# EAGLE design simplux (EAGLE 5.10)
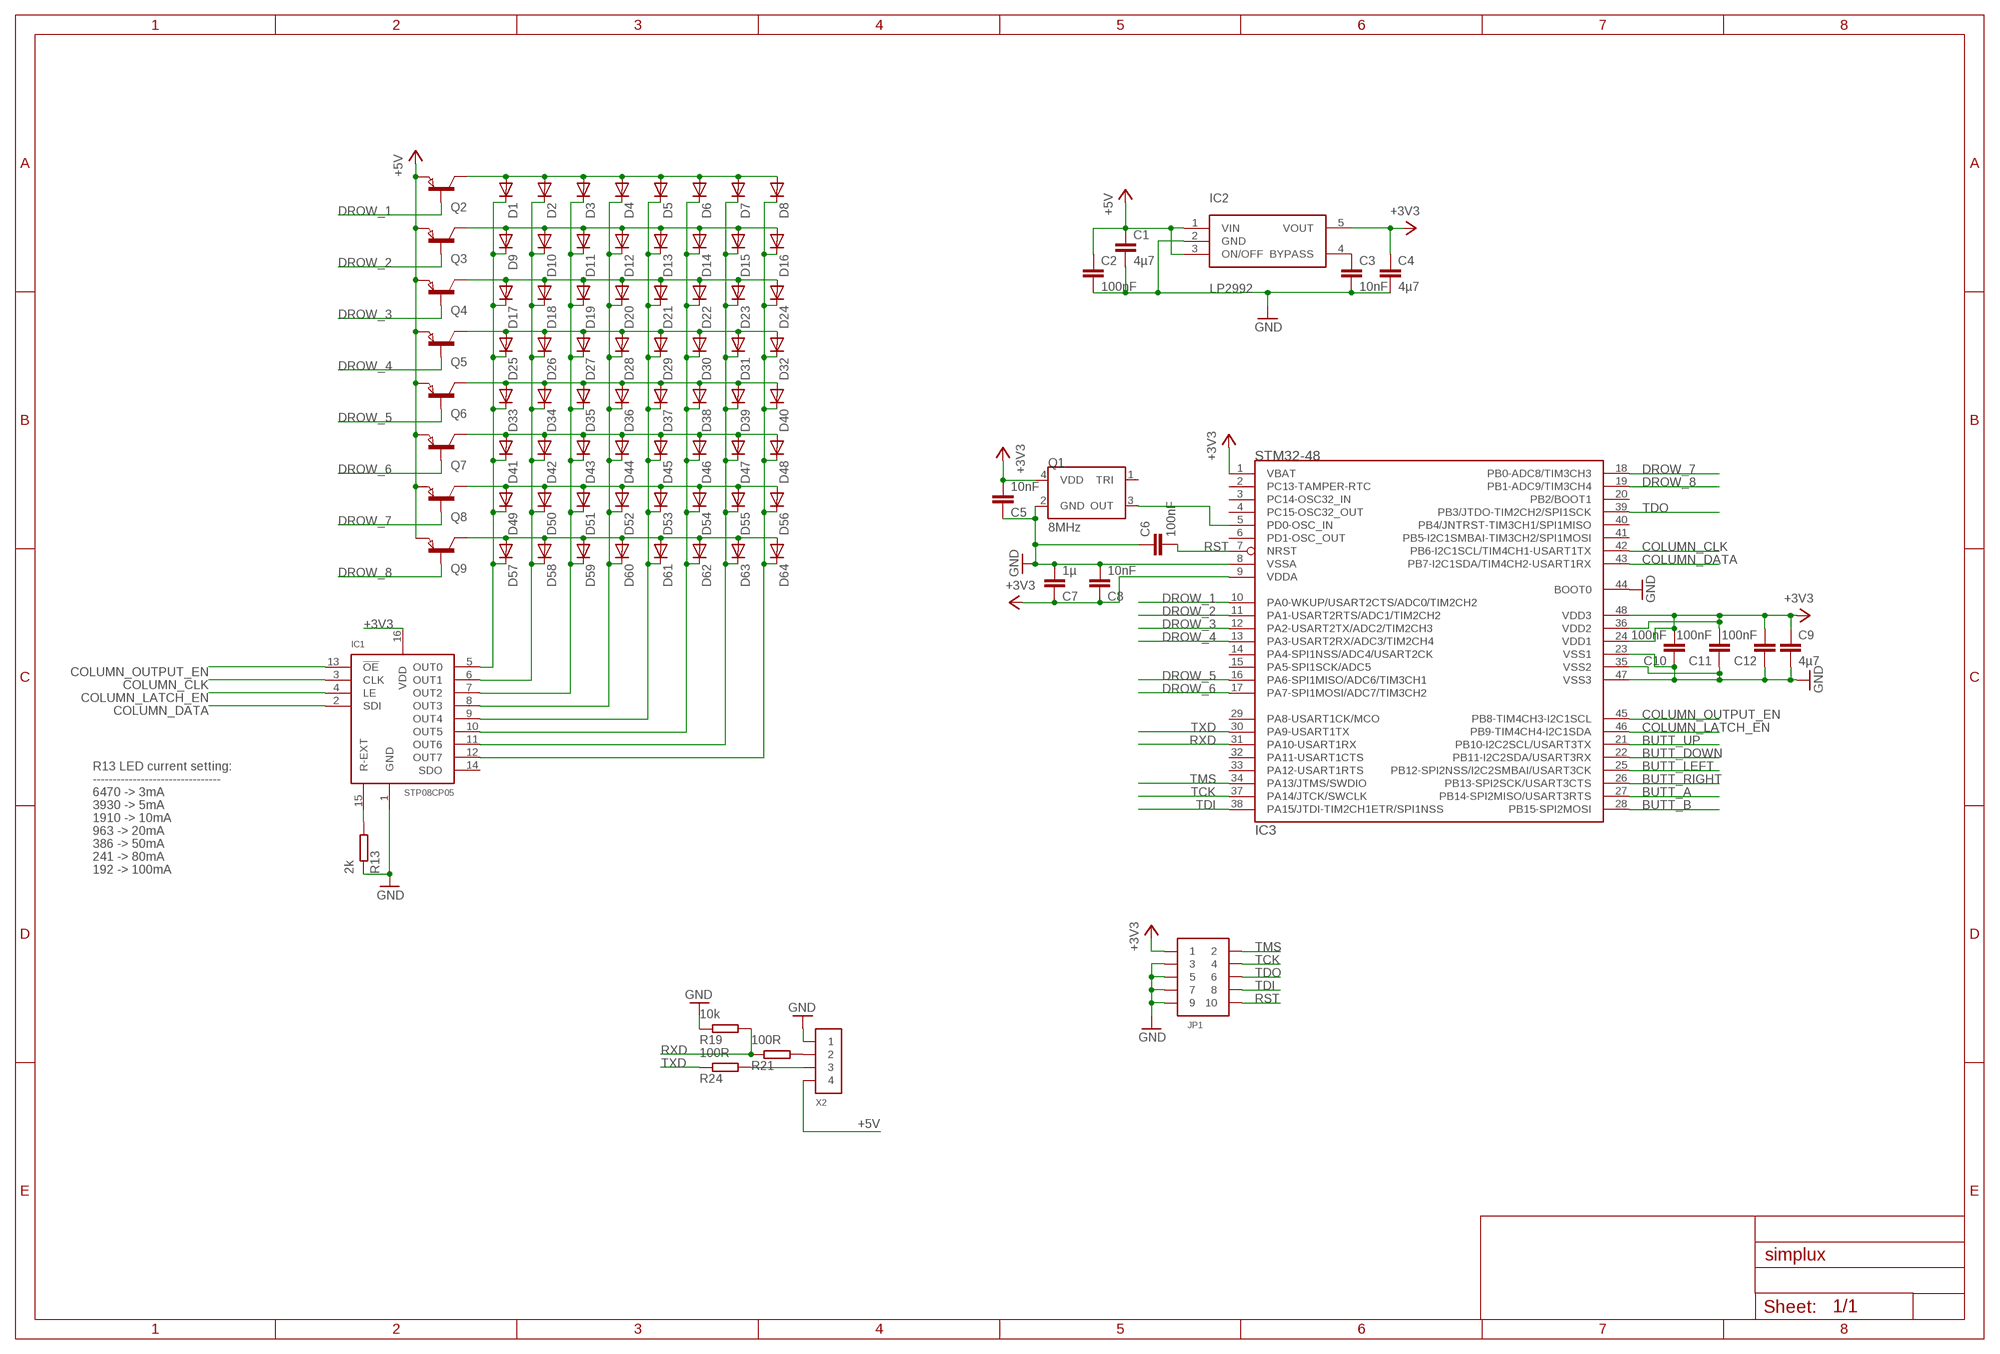
[diagram p0: schematic, sheet 1]

## Parts
C1  4µ7  CAPACITOR-0603  [0603-CAP]
C2  100nF  CAPACITOR-0603  [0603-CAP]
C3  10nF  CAPACITOR-0603  [0603-CAP]
C4  4µ7  CAPACITOR-0603  [0603-CAP]
C5  10nF  CAPACITOR-0603  [0603-CAP]
C6  100nF  CAPACITOR-0603  [0603-CAP]
C7  1µ  CAPACITOR-0603  [0603-CAP]
C8  10nF  CAPACITOR-0603  [0603-CAP]
C9  4µ7  CAPACITOR-0603  [0603-CAP]
C10  100nF  CAPACITOR-0603  [0603-CAP]
C11  100nF  CAPACITOR-0603  [0603-CAP]
C12  100nF  CAPACITOR-0603  [0603-CAP]
D1  DIODE-0603  [0603-LED]
D2  DIODE-0603  [0603-LED]
D3  DIODE-0603  [0603-LED]
D4  DIODE-0603  [0603-LED]
D5  DIODE-0603  [0603-LED]
D6  DIODE-0603  [0603-LED]
D7  DIODE-0603  [0603-LED]
D8  DIODE-0603  [0603-LED]
D9  DIODE-0603  [0603-LED]
D10  DIODE-0603  [0603-LED]
D11  DIODE-0603  [0603-LED]
D12  DIODE-0603  [0603-LED]
D13  DIODE-0603  [0603-LED]
D14  DIODE-0603  [0603-LED]
D15  DIODE-0603  [0603-LED]
D16  DIODE-0603  [0603-LED]
D17  DIODE-0603  [0603-LED]
D18  DIODE-0603  [0603-LED]
D19  DIODE-0603  [0603-LED]
D20  DIODE-0603  [0603-LED]
D21  DIODE-0603  [0603-LED]
D22  DIODE-0603  [0603-LED]
D23  DIODE-0603  [0603-LED]
D24  DIODE-0603  [0603-LED]
D25  DIODE-0603  [0603-LED]
D26  DIODE-0603  [0603-LED]
D27  DIODE-0603  [0603-LED]
D28  DIODE-0603  [0603-LED]
D29  DIODE-0603  [0603-LED]
D30  DIODE-0603  [0603-LED]
D31  DIODE-0603  [0603-LED]
D32  DIODE-0603  [0603-LED]
D33  DIODE-0603  [0603-LED]
D34  DIODE-0603  [0603-LED]
D35  DIODE-0603  [0603-LED]
D36  DIODE-0603  [0603-LED]
D37  DIODE-0603  [0603-LED]
D38  DIODE-0603  [0603-LED]
D39  DIODE-0603  [0603-LED]
D40  DIODE-0603  [0603-LED]
D41  DIODE-0603  [0603-LED]
D42  DIODE-0603  [0603-LED]
D43  DIODE-0603  [0603-LED]
D44  DIODE-0603  [0603-LED]
D45  DIODE-0603  [0603-LED]
D46  DIODE-0603  [0603-LED]
D47  DIODE-0603  [0603-LED]
D48  DIODE-0603  [0603-LED]
D49  DIODE-0603  [0603-LED]
D50  DIODE-0603  [0603-LED]
D51  DIODE-0603  [0603-LED]
D52  DIODE-0603  [0603-LED]
D53  DIODE-0603  [0603-LED]
D54  DIODE-0603  [0603-LED]
D55  DIODE-0603  [0603-LED]
D56  DIODE-0603  [0603-LED]
D57  DIODE-0603  [0603-LED]
D58  DIODE-0603  [0603-LED]
D59  DIODE-0603  [0603-LED]
D60  DIODE-0603  [0603-LED]
D61  DIODE-0603  [0603-LED]
D62  DIODE-0603  [0603-LED]
D63  DIODE-0603  [0603-LED]
D64  DIODE-0603  [0603-LED]
IC1  STP08CP05  [TSSOP16]
IC2  LP2992  [SOT23-5]
IC3  STM32-48  [LQFP48]
JP1  PIN_HDR_EDG_1.27MM_5-2-DH  [PIN_HDR_1.27MM_SMD_DH_10]
Q1  8MHz  ASE_ASCILLATOR  [ASE_OSCILLATOR]
Q2  PNP-TRANSISTOR_SOT23  [SOT23]
Q3  PNP-TRANSISTOR_SOT23  [SOT23]
Q4  PNP-TRANSISTOR_SOT23  [SOT23]
Q5  PNP-TRANSISTOR_SOT23  [SOT23]
Q6  PNP-TRANSISTOR_SOT23  [SOT23]
Q7  PNP-TRANSISTOR_SOT23  [SOT23]
Q8  PNP-TRANSISTOR_SOT23  [SOT23]
Q9  PNP-TRANSISTOR_SOT23  [SOT23]
R13  2k  RESISTOR-0603  [0603-RES]
R19  10k  RESISTOR-0603  [0603-RES]
R21  100R  RESISTOR-0603  [0603-RES]
R24  100R  RESISTOR-0603  [0603-RES]
X2  CONN_4-1-53261  [PB-53261-04]

## Nets
+3V3: C4.P$1 C5.P$2 C7.P$1 C8.P$1 C9.P$1 C10.P$2 C11.P$2 C12.P$2 IC1.16(VDD) IC2.5(VOUT) IC3.1(VBAT) IC3.9(VDDA) IC3.24(VDD1) IC3.36(VDD2) IC3.48(VDD3) JP1.1 Q1.4(VDD)
+5V: C1.P$1 C2.P$1 IC2.1(VIN) IC2.3(ON/OFF) Q2.2(E) Q3.2(E) Q4.2(E) Q5.2(E) Q6.2(E) Q7.2(E) Q8.2(E) Q9.2(E) X2.4
BUTT_A: IC3.27(PB14-SPI2MISO/USART3RTS)
BUTT_B: IC3.28(PB15-SPI2MOSI)
BUTT_DOWN: IC3.22(PB11-I2C2SDA/USART3RX)
BUTT_LEFT: IC3.25(PB12-SPI2NSS/I2C2SMBAI/USART3CK)
BUTT_RIGHT: IC3.26(PB13-SPI2SCK/USART3CTS)
BUTT_UP: IC3.21(PB10-I2C2SCL/USART3TX)
COL_A: D1.C D9.C D17.C D25.C D33.C D41.C D49.C D57.C IC1.5(OUT0)
COL_B: D2.C D10.C D18.C D26.C D34.C D42.C D50.C D58.C IC1.6(OUT1)
COL_C: D3.C D11.C D19.C D27.C D35.C D43.C D51.C D59.C IC1.7(OUT2)
COL_D: D4.C D12.C D20.C D28.C D36.C D44.C D52.C D60.C IC1.8(OUT3)
COL_E: D5.C D13.C D21.C D29.C D37.C D45.C D53.C D61.C IC1.9(OUT4)
COL_F: D6.C D14.C D22.C D30.C D38.C D46.C D54.C D62.C IC1.10(OUT5)
COL_G: D7.C D15.C D23.C D31.C D39.C D47.C D55.C D63.C IC1.11(OUT6)
COL_H: D8.C D16.C D24.C D32.C D40.C D48.C D56.C D64.C IC1.12(OUT7)
COLUMN_CLK: IC1.3(CLK) IC3.42(PB6-I2C1SCL/TIM4CH1-USART1TX)
COLUMN_DATA: IC1.2(SDI) IC3.43(PB7-I2C1SDA/TIM4CH2-USART1RX)
COLUMN_LATCH_EN: IC1.4(LE) IC3.46(PB9-TIM4CH4-I2C1SDA)
COLUMN_OUTPUT_EN: IC1.13(!OE) IC3.45(PB8-TIM4CH3-I2C1SCL)
DROW_1: IC3.10(PA0-WKUP/USART2CTS/ADC0/TIM2CH2) Q2.1(B)
DROW_2: IC3.11(PA1-USART2RTS/ADC1/TIM2CH2) Q3.1(B)
DROW_3: IC3.12(PA2-USART2TX/ADC2/TIM2CH3) Q4.1(B)
DROW_4: IC3.13(PA3-USART2RX/ADC3/TIM2CH4) Q5.1(B)
DROW_5: IC3.16(PA6-SPI1MISO/ADC6/TIM3CH1) Q6.1(B)
DROW_6: IC3.17(PA7-SPI1MOSI/ADC7/TIM3CH2) Q7.1(B)
DROW_7: IC3.18(PB0-ADC8/TIM3CH3) Q8.1(B)
DROW_8: IC3.19(PB1-ADC9/TIM3CH4) Q9.1(B)
GND: C1.P$2 C2.P$2 C3.P$2 C4.P$2 C5.P$1 C6.P$1 C7.P$2 C8.P$2 C9.P$2 C10.P$1 C11.P$1 C12.P$1 IC1.1(GND) IC2.2(GND) IC3.8(VSSA) IC3.23(VSS1) IC3.35(VSS2) IC3.44(BOOT0) IC3.47(VSS3) JP1.3 JP1.5 JP1.7 JP1.9 Q1.2(GND) R13.P$1 R19.P$1 X2.1
N$2: IC1.15(R-EXT) R13.P$2
N$6: R21.P$2 X2.2
N$20: R24.P$2 X2.3
N$22: C3.P$1 IC2.4(BYPASS)
N$40: IC3.5(PD0-OSC_IN) Q1.3(OUT)
ROW_1: D1.A D2.A D3.A D4.A D5.A D6.A D7.A D8.A Q2.3(C)
ROW_2: D9.A D10.A D11.A D12.A D13.A D14.A D15.A D16.A Q3.3(C)
ROW_3: D17.A D18.A D19.A D20.A D21.A D22.A D23.A D24.A Q4.3(C)
ROW_4: D25.A D26.A D27.A D28.A D29.A D30.A D31.A D32.A Q5.3(C)
ROW_5: D33.A D34.A D35.A D36.A D37.A D38.A D39.A D40.A Q6.3(C)
ROW_6: D41.A D42.A D43.A D44.A D45.A D46.A D47.A D48.A Q7.3(C)
ROW_7: D49.A D50.A D51.A D52.A D53.A D54.A D55.A D56.A Q8.3(C)
ROW_8: D57.A D58.A D59.A D60.A D61.A D62.A D63.A D64.A Q9.3(C)
RST: C6.P$2 IC3.7(NRST) JP1.10
RXD: IC3.31(PA10-USART1RX) R19.P$2 R21.P$1
TCK: IC3.37(PA14/JTCK/SWCLK) JP1.4
TDI: IC3.38(PA15/JTDI-TIM2CH1ETR/SPI1NSS) JP1.8
TDO: IC3.39(PB3/JTDO-TIM2CH2/SPI1SCK) JP1.6
TMS: IC3.34(PA13/JTMS/SWDIO) JP1.2
TXD: IC3.30(PA9-USART1TX) R24.P$1
Unconnected: IC1.14(SDO) IC3.2(PC13-TAMPER-RTC) IC3.3(PC14-OSC32_IN) IC3.4(PC15-OSC32_OUT) IC3.6(PD1-OSC_OUT) IC3.14(PA4-SPI1NSS/ADC4/USART2CK) IC3.15(PA5-SPI1SCK/ADC5) IC3.20(PB2/BOOT1) IC3.29(PA8-USART1CK/MCO) IC3.32(PA11-USART1CTS) IC3.33(PA12-USART1RTS) IC3.40(PB4/JNTRST-TIM3CH1/SPI1MISO) IC3.41(PB5-I2C1SMBAI-TIM3CH2/SPI1MOSI) Q1.1(TRI)

## Notes on the sheet
- R13 LED current setting:
- --------------------------------
- 6470 -> 3mA
- 3930 -> 5mA
- 1910 -> 10mA
- 963 -> 20mA
- 386 -> 50mA
- 241 -> 80mA
- 192 -> 100mA

## Library data of the parts
C1-C12 = pel_dipol_comp:CAPACITOR
D1-D64 = pel_dipol_comp:DIODE
IC1 = booz:STP08CP05
IC2 = open-bldc:LP2992
IC3 = open-bldc:STM32-48
JP1 = open-bldc:PIN_HDR_EDG_1.27MM_5-2
Q1 = open-bldc:ASE_ASCILLATOR
Q2-Q9 = semicon-smd-ipc:PNP-TRANSISTOR_: PNP TRANSISTOR
R13 R19 R21 R24 = pel_dipol_comp:RESISTOR
X2 = pel_molex:CONN_4-1

## Board
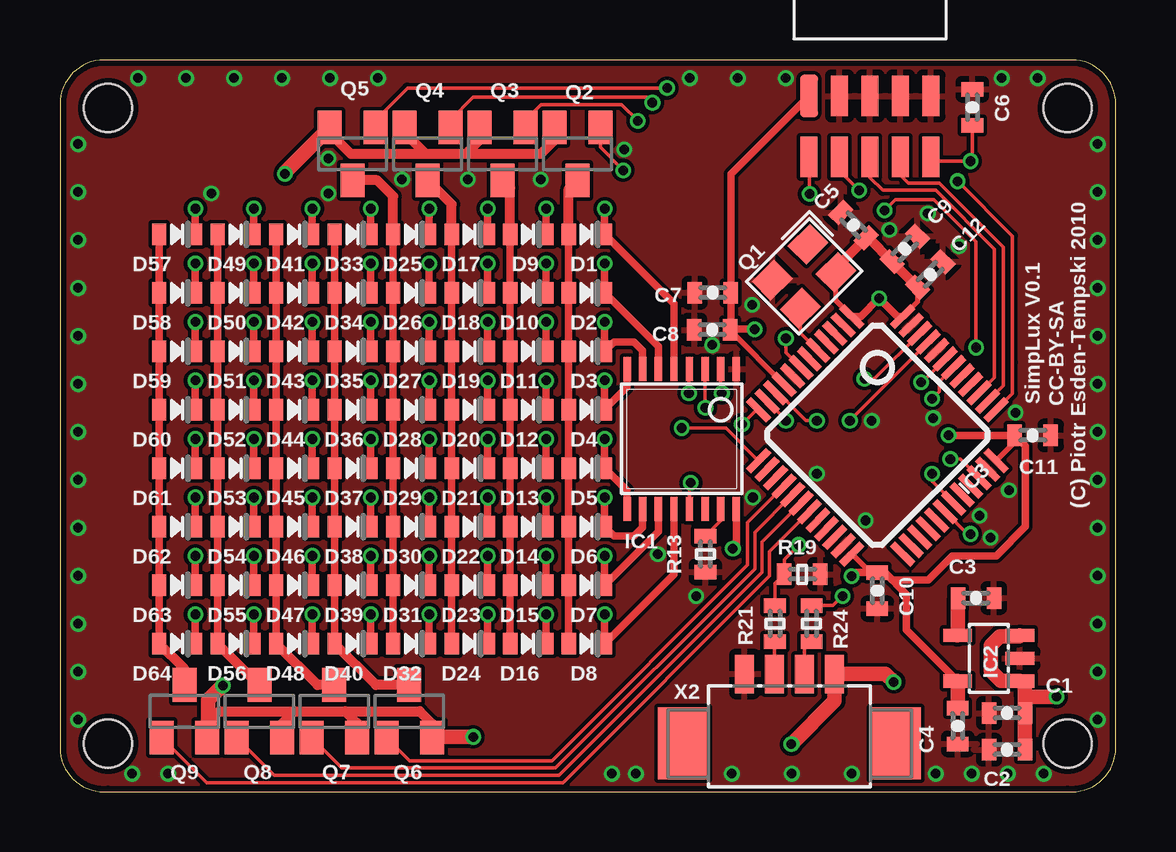
[diagram p1: board, top side]
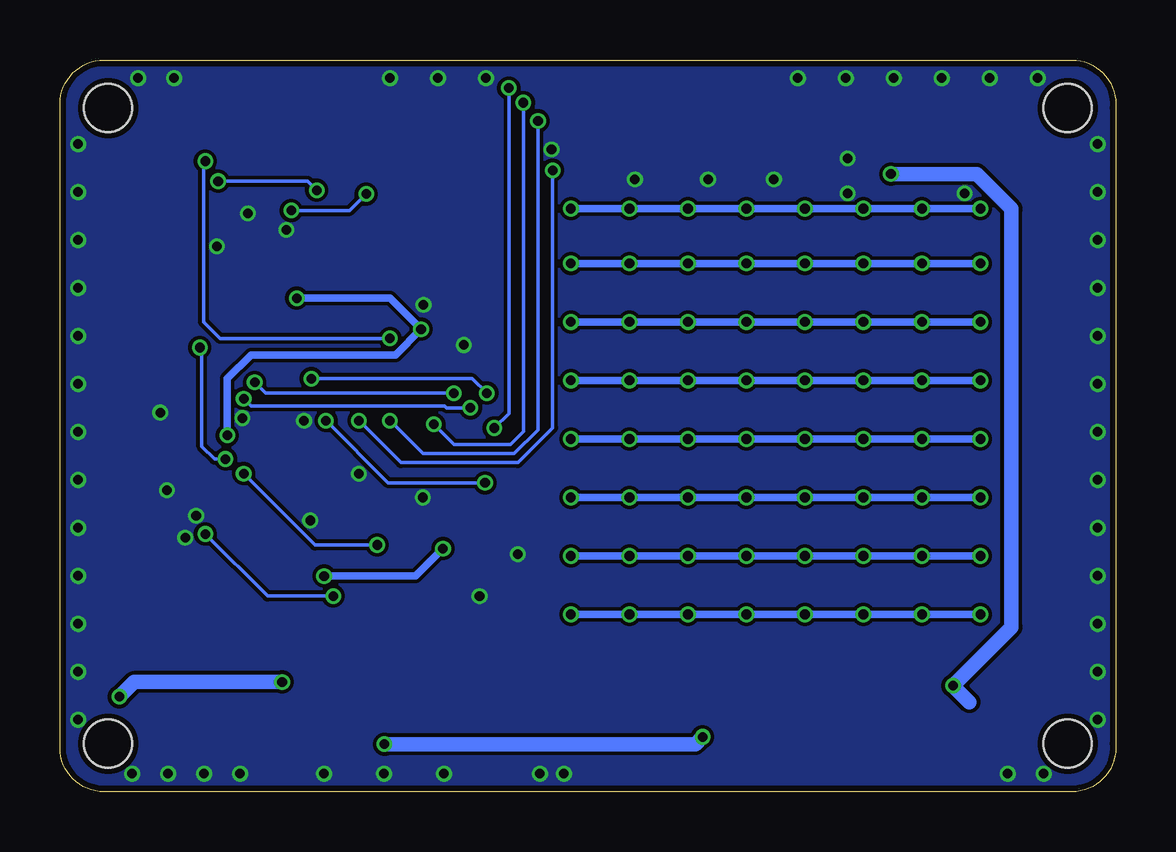
[diagram p2: board, bottom side, seen from below]

Size 44.01 x 30.51 mm. Coordinates in mm from the lower left corner, seen from the top.
Outline: 0.01,2.01 arc100 2.01,0.01 42.01,0.01 arc100 44.01,2.01 44.01,28.51 arc100 42.01,30.51 2.01,30.51 arc100 0.01,28.51 0.01,2.01
Copper layers (1*16): Top 0.035mm / dielectric 1.5mm / Bottom 0.035mm
Design rules "default *": minimum track width 6mil, minimum drill 0.4mm, track to track 6mil, track to pad 6mil, pad to pad 6mil, via to via 6mil, smd to smd 6mil, copper to edge 10mil, drill to drill 6mil, minimum pad ring 7mil, minimum via ring 5mil, stop-mask expansion 4mil, vias tented up to drill 0mil, thermal gap 10mil
Holes 2 mm at 2.01,2.01 2.01,28.51 42.01,28.51 42.01,2.01

### Footprints (pad centres in the part's own frame; a part is rotated, then mirrored left to right if it is on the bottom)
0603-CAP = smd 0.6 x 0.9: P$1 -0.75,0; P$2 0.75,0
0603-LED = smd 0.6 x 0.9: A 0.75,0; C -0.75,0
TSSOP16 = smd 0.305 x 0.991: 1 -2.275,-2.918; 2 -1.625,-2.918; 3 -0.975,-2.918; 4 -0.325,-2.918; 5 0.325,-2.918; 6 0.975,-2.918; 7 1.625,-2.918; 8 2.275,-2.918; 9 2.275,2.918; 10 1.625,2.918; 11 0.975,2.918; 12 0.325,2.918; 13 -0.325,2.918; 14 -0.975,2.918; 15 -1.625,2.918; 16 -2.275,2.918
SOT23-5 = smd 0.55 x 1.2: 1 -0.95,-1.3; 2 0,-1.3; 3 0.95,-1.3; 4 0.95,1.3; 5 -0.95,1.3
LQFP48 = smd 0.3 x 1.2: 1 -2.75,-4.25; 2 -2.25,-4.25; 3 -1.75,-4.25; 4 -1.25,-4.25; 5 -0.75,-4.25; 6 -0.25,-4.25; 7 0.25,-4.25; 8 0.75,-4.25; 9 1.25,-4.25; 10 1.75,-4.25; 11 2.25,-4.25; 12 2.75,-4.25; 25 2.75,4.25; 26 2.25,4.25; 27 1.75,4.25; 28 1.25,4.25; 29 0.75,4.25; 30 0.25,4.25; 31 -0.25,4.25; 32 -0.75,4.25; 33 -1.25,4.25; 34 -1.75,4.25; 35 -2.25,4.25; 36 -2.75,4.25 | smd 1.2 x 0.3: 13 4.25,-2.75; 14 4.25,-2.25; 15 4.25,-1.75; 16 4.25,-1.25; 17 4.25,-0.75; 18 4.25,-0.25; 19 4.25,0.25; 20 4.25,0.75; 21 4.25,1.25; 22 4.25,1.75; 23 4.25,2.25; 24 4.25,2.75; 37 -4.25,2.75; 38 -4.25,2.25; 39 -4.25,1.75; 40 -4.25,1.25; 41 -4.25,0.75; 42 -4.25,0.25; 43 -4.25,-0.25; 44 -4.25,-0.75; 45 -4.25,-1.25; 46 -4.25,-1.75; 47 -4.25,-2.25; 48 -4.25,-2.75
PIN_HDR_1.27MM_SMD_DH_10 = smd 1.78 x 0.76: 1 -1.27,-2.54 | smd 1.702 x 0.711: 2 1.27,-2.54; 3 -1.27,-1.27; 4 1.27,-1.27; 5 -1.27,0; 6 1.27,0; 7 -1.27,1.27; 8 1.27,1.27; 9 -1.27,2.54; 10 1.27,2.54
ASE_OSCILLATOR = smd 1.3 x 1.1: 1 -1.05,-0.825; 2 1.05,-0.825; 3 1.05,0.825; 4 -1.05,0.825
SOT23 = smd 1 x 1.4: 1 -0.95,-1.1; 2 0.95,-1.1; 3 0,1.1
0603-RES = smd 0.6 x 0.9: P$1 -0.75,0; P$2 0.75,0
PB-53261-04 = smd 0.8 x 1.6: 1 -1.875,1.1; 2 -0.625,1.1; 3 0.625,1.1; 4 1.875,1.1 | smd 2.1 x 3: MNT1 -4.425,-1.8; MNT2 4.425,-1.8

### Placement (x,y rotation side)
C1  39.48,3.28 180 top
C2  39.48,1.76 180 top
C3  38.18,8.08 0 top
C4  37.42,2.75 270 top
C5  33.08,23.63 315 top
C6  38.03,28.54 270 top
C7  27.21,20.81 180 top
C8  27.19,19.26 180 top
C9  35.21,22.64 45 top
C10  34.07,8.39 90 top
C11  40.55,14.87 180 top
C12  36.28,21.57 225 top
D1  21.95,23.25 180 top
D2  21.95,20.81 180 top
D3  21.95,18.37 180 top
D4  21.95,15.93 180 top
D5  21.95,13.49 180 top
D6  21.95,11.06 180 top
D7  21.95,8.62 180 top
D8  21.95,6.18 180 top
D9  19.51,23.25 180 top
D10  19.51,20.81 180 top
D11  19.51,18.37 180 top
D12  19.51,15.93 180 top
D13  19.51,13.49 180 top
D14  19.51,11.06 180 top
D15  19.51,8.62 180 top
D16  19.51,6.18 180 top
D17  17.08,23.25 180 top
D18  17.08,20.81 180 top
D19  17.08,18.37 180 top
D20  17.08,15.93 180 top
D21  17.08,13.49 180 top
D22  17.08,11.06 180 top
D23  17.08,8.62 180 top
D24  17.08,6.18 180 top
D25  14.64,23.25 180 top
D26  14.64,20.81 180 top
D27  14.64,18.37 180 top
D28  14.64,15.93 180 top
D29  14.64,13.49 180 top
D30  14.64,11.06 180 top
D31  14.64,8.62 180 top
D32  14.64,6.18 180 top
D33  12.2,23.25 180 top
D34  12.2,20.81 180 top
D35  12.2,18.37 180 top
D36  12.2,15.93 180 top
D37  12.2,13.49 180 top
D38  12.2,11.06 180 top
D39  12.2,8.62 180 top
D40  12.2,6.18 180 top
D41  9.76,23.25 180 top
D42  9.76,20.81 180 top
D43  9.76,18.37 180 top
D44  9.76,15.93 180 top
D45  9.76,13.49 180 top
D46  9.76,11.06 180 top
D47  9.76,8.62 180 top
D48  9.76,6.18 180 top
D49  7.32,23.25 180 top
D50  7.32,20.81 180 top
D51  7.32,18.37 180 top
D52  7.32,15.93 180 top
D53  7.32,13.49 180 top
D54  7.32,11.06 180 top
D55  7.32,8.62 180 top
D56  7.32,6.18 180 top
D57  4.88,23.25 180 top
D58  4.88,20.81 180 top
D59  4.88,18.37 180 top
D60  4.88,15.93 180 top
D61  4.88,13.49 180 top
D62  4.88,11.06 180 top
D63  4.88,8.62 180 top
D64  4.88,6.18 180 top
IC1  25.91,14.71 180 top
IC2  38.72,5.57 90 top
IC3  34.07,14.87 225 top
JP1  33.76,27.74 270 top
Q1  31.02,21.5 225 top
Q2  21.57,26.6 180 top
Q3  18.45,26.6 180 top
Q4  15.32,26.6 180 top
Q5  12.2,26.6 180 top
Q6  14.56,3.36 0 top
Q7  11.44,3.36 0 top
Q8  8.31,3.36 0 top
Q9  5.19,3.36 0 top
R13  26.91,9.91 90 top
R19  30.94,9.07 180 top
R21  29.8,7.02 270 top
R24  31.33,7.02 270 top
X2  30.41,3.82 0 top

### Tracks (layer width: path | path; a pad name or v marks a point on that pad's centre or on a via)
+3V3  (via drill 0.4)
  Top 0.203: C12.P$2 35.75,20.43 IC3.48 | Q1.4 32.35,20.48 IC3.1 | C8.P$1 27.94,19.23 IC3.9 | C10.P$2 33.99,9.14 33.78,9.14 IC3.24 | C11.P$2 39.79,14.58 IC3.36
  Top 0.305: 27.96,19.29 C7.P$1 27.96,25.75 JP1.1 | 27.96,19.29 C8.P$1 27.96,19.29 | IC2.5 35.29,6.75 35.29,8.24 34.38,9.14 | C10.P$2 34.38,9.14 | 34.38,9.14 34.68,8.85 36.2,8.85 37.19,9.84 39.02,9.84 40.24,11.06 40.24,13.57 40.24,14.42 C11.P$2 v37.04,14.87 | 33.99,9.14 33.14,9.14 v33,9 | v28.05,10.14 28.19,10.28 IC1.16 | v28.96,19.29 27.96,19.29 | IC3.1 33.38,19.82 v34.14,20.58 34.91,19.82 IC3.48
  Top 0.406: Q1.4 32.35,21.84 C5.P$2 33.69,23.1 C9.P$1 C12.P$2
  Top 0.61: C4.P$1 IC2.5
  Bottom 0.305: v33,9 29.19,9 v28.05,10.14 | v37.04,14.87 37.04,17.23 36.05,18.22 30.03,18.22 v28.96,19.29 30.26,20.58 v34.14,20.58
+5V  (via drill 0.4)
  Top 0.406: Q5.2 11.25,27.47 12.12,26.6 15.25,26.6 | 16.92,26.6 16.85,26.6 15.25,26.6 | 16.92,26.6 20.05,26.6 20.62,27.17 Q2.2 | Q4.2 14.37,27.47 15.25,26.6 | Q9.2 6.14,2.86 6.64,3.36 9.76,3.36 | 11.89,3.36 14.99,3.36 15.51,2.84 Q6.2 | 9.76,3.36 11.89,3.36 | Q8.2 9.26,2.86 9.76,3.36 | Q3.2 17.5,27.17 16.92,26.6 | Q7.2 12.39,2.87 11.89,3.36
  Top 0.61: Q9.2 6.18,2.3 6.18,3.64 6.18,3.84 6.76,4.43 v6.79,4.43 | v9.38,25.76 9.38,25.83 Q5.2 | C2.P$1 C1.P$1 40.23,3.97 | 40.23,3.97 40.23,4.41 IC2.1 39.21,4.62 38.79,5.04 38.79,6.1 39.17,6.48 39.98,6.48 IC2.3 | v30.49,1.99 32.29,3.79 X2.4 34.42,4.92 v34.75,4.58 | v17.23,2.29 15.54,2.29 Q6.2 | v41.54,3.97 40.23,3.97
  Bottom 0.61: 6.1,3.74 v6.79,4.43 4.35,6.86 4.35,24.31 5.8,25.76 v9.38,25.76 | v30.49,1.99 17.53,1.99 v17.23,2.29 | v34.75,4.58 40.93,4.58 v41.54,3.97
COL_A  (via drill 0.4)
  Top 0.305: D57.C 5.63,24.3 v5.65,24.31 | D49.C 8.07,24.3 v8.08,24.31 | v22.71,24.31 22.7,24.3 D1.C 25.59,20.36 IC1.5 | D9.C 20.26,24.3 v20.28,24.31 | D17.C 17.83,24.3 v17.84,24.31 | D25.C 15.39,24.3 v15.4,24.31 | D33.C 12.95,24.3 v12.96,24.31 | D41.C 10.51,24.3 v10.52,24.31
  Bottom 0.305: v22.71,24.31 v20.28,24.31 v17.84,24.31 v15.4,24.31 v12.96,24.31 v10.52,24.31 v8.08,24.31 v5.65,24.31
COL_B  (via drill 0.4)
  Top 0.305: D58.C 5.63,22.02 v5.65,22.03 | D50.C 8.07,22.02 v8.08,22.03 | D42.C 10.51,22.02 v10.52,22.03 | D34.C v12.95,22.02 v12.96,22.03 | D26.C v15.39,22.02 v15.4,22.03 | D18.C 17.83,22.02 v17.84,22.03 | D10.C 20.26,22.02 v20.28,22.03 | v22.71,22.03 22.7,22.02 D2.C 24.94,18.57 IC1.6
  Bottom 0.305: v22.71,22.03 v20.28,22.03 v17.84,22.03 v15.4,22.03 v12.96,22.03 v10.52,22.03 v8.08,22.03 v5.65,22.03
COL_C  (via drill 0.4)
  Top 0.305: D59.C 5.63,19.58 v5.65,19.59 | D51.C 8.07,19.58 v8.08,19.59 | D43.C 10.51,19.58 v10.52,19.59 | D35.C v12.95,19.58 v12.96,19.59 | D27.C v15.39,19.58 v15.4,19.59 | D19.C 17.83,19.58 v17.84,19.59 | D11.C 20.26,19.58 v20.28,19.59 | v22.71,19.59 22.7,19.58 D3.C 23.08,18.75 23.93,18.75 24.29,18.4 IC1.7
  Bottom 0.305: v22.71,19.59 v20.28,19.59 v17.84,19.59 v15.4,19.59 v12.96,19.59 v10.52,19.59 v8.08,19.59 v5.65,19.59
COL_D  (via drill 0.4)
  Top 0.305: D60.C 5.63,17.14 v5.65,17.15 | D52.C 8.07,17.14 v8.08,17.15 | D44.C 10.51,17.14 v10.52,17.15 | D36.C v12.95,17.14 v12.96,17.15 | D28.C v15.39,17.14 v15.4,17.15 | D20.C 17.83,17.14 v17.84,17.15 | D12.C 20.26,17.14 v20.28,17.15 | v22.71,17.15 22.7,17.14 D4.C 23.64,16.87 IC1.8
  Bottom 0.305: v22.71,17.15 v20.28,17.15 v17.84,17.15 v15.4,17.15 v12.96,17.15 v10.52,17.15 v8.08,17.15 v5.65,17.15
COL_E  (via drill 0.4)
  Top 0.305: D61.C 5.63,14.7 v5.65,14.71 | D53.C 8.07,14.7 v8.08,14.71 | D45.C 10.51,14.7 v10.52,14.71 | D37.C 12.95,14.7 v12.96,14.71 | D29.C 15.39,14.7 v15.4,14.71 | D21.C 17.83,14.7 v17.84,14.71 | D13.C 20.26,14.7 v20.28,14.71 | v22.71,14.71 22.7,14.7 D5.C 23.64,12.56 IC1.9
  Bottom 0.305: v22.71,14.71 v20.28,14.71 v17.84,14.71 v15.4,14.71 v12.96,14.71 v10.52,14.71 v8.08,14.71 v5.65,14.71
COL_F  (via drill 0.4)
  Top 0.305: D62.C 5.63,12.26 v5.65,12.27 | v22.71,12.27 22.7,12.26 D6.C 23.08,10.67 23.93,10.67 24.29,11.03 IC1.10 | D54.C 8.07,12.26 v8.08,12.27 | D46.C 10.51,12.26 v10.52,12.27 | D38.C 12.95,12.26 v12.96,12.27 | D30.C 15.39,12.26 v15.4,12.27 | D22.C 17.83,12.26 v17.84,12.27 | D14.C 20.26,12.26 v20.28,12.27
  Bottom 0.305: v22.71,12.27 v20.28,12.27 v17.84,12.27 v15.4,12.27 v12.96,12.27 v10.52,12.27 v8.08,12.27 v5.65,12.27
COL_G  (via drill 0.4)
  Top 0.305: D63.C 5.63,9.82 v5.65,9.84 | v22.71,9.84 22.7,9.82 D7.C 24.94,10.85 IC1.11 | D55.C 8.07,9.82 v8.08,9.84 | D47.C 10.51,9.82 v10.52,9.84 | D39.C 12.95,9.82 v12.96,9.84 | D31.C 15.39,9.82 v15.4,9.84 | D23.C 17.83,9.82 v17.84,9.84 | D15.C 20.26,9.82 v20.28,9.84
  Bottom 0.305: v22.71,9.84 v20.28,9.84 v17.84,9.84 v15.4,9.84 v12.96,9.84 v10.52,9.84 v8.08,9.84 v5.65,9.84
COL_H  (via drill 0.4)
  Top 0.305: D64.C 5.63,7.39 v5.65,7.4 | v22.71,7.4 22.7,7.39 D8.C 25.59,9.07 IC1.12 | D56.C 8.07,7.39 v8.08,7.4 | D48.C 10.51,7.39 v10.52,7.4 | D40.C 12.95,7.39 v12.96,7.4 | D32.C 15.39,7.39 v15.4,7.4 | D16.C 20.26,7.39 v20.28,7.4 | D24.C 17.83,7.39 v17.84,7.4
  Bottom 0.305: v22.71,7.4 v20.28,7.4 v17.84,7.4 v15.4,7.4 v12.96,7.4 v10.52,7.4 v8.08,7.4 v5.65,7.4
COLUMN_CLK  (via drill 0.4)
  Top 0.152: v26.91,16.01 26.89,16.02 IC1.3 | v36.35,16.39 36.66,16.69 36.66,17.1 IC3.42
  Bottom 0.152: v36.35,16.39 36.05,16.08 27.97,16.08 27.9,16.01 v26.91,16.01
COLUMN_DATA  (via drill 0.4)
  Top 0.152: IC3.43 35.92,17.08 v35.9,17.08 | v27.59,16.62 27.54,16.67 IC1.2
  Bottom 0.152: v35.9,17.08 35.44,16.62 v27.59,16.62
COLUMN_LATCH_EN  (via drill 0.4)
  Top 0.152: IC3.46 33.96,17.23 v33.53,17.23 | v26.22,16.62 26.22,17.61 IC1.4
  Bottom 0.152: v33.53,17.23 26.83,17.23 v26.22,16.62
COLUMN_OUTPUT_EN  (via drill 0.4)
  Top 0.152: IC3.45 32.92,15.49 v32.92,15.48 | v26.3,12.88 26.24,12.83 IC1.13
  Bottom 0.152: v32.92,15.48 30.33,12.88 v26.3,12.88
DROW_1  (via drill 0.4)
  Top 0.152: IC3.10 29.94,16.63 31.1,15.48 v31.55,15.48 | v23.48,25.91 22.52,26.87 Q2.1
  Bottom 0.152: v31.55,15.48 29.8,13.72 24.92,13.72 23.48,15.17 v23.48,25.91
DROW_2  (via drill 0.4)
  Top 0.152: Q3.1 19.4,28.01 20.05,28.66 23.4,28.66 v24.09,27.97 | IC3.11 30.26,15.49 v30.26,15.48
  Bottom 0.152: v30.26,15.48 28.89,14.1 25.08,14.1 24.09,15.09 v24.09,27.97
DROW_3  (via drill 0.4)
  Top 0.152: Q4.1 16.27,28.01 17.23,28.96 24.47,28.96 v24.7,28.73 | IC3.12 29.03,15.93 v28.43,15.32
  Bottom 0.152: v28.43,15.32 27.59,14.48 25.23,14.48 24.7,15.02 v24.7,28.73
DROW_4  (via drill 0.4)
  Top 0.152: Q5.1 13.15,28.01 14.48,29.34 v25.3,29.34 | IC3.13 27.75,15.17 v25.91,15.17
  Bottom 0.152: v25.91,15.17 25.3,15.78 v25.3,29.34
DROW_5
  Top 0.152: Q6.1 14.57,1.3 16.16,1.3 20.5,1.3 28.66,9.46 28.66,11.22 IC3.16
DROW_6
  Top 0.152: Q7.1 11.75,1 16.31,1 20.66,1 28.96,9.3 28.96,10.82 IC3.17
DROW_7
  Top 0.152: Q8.1 8.93,0.69 16.16,0.69 16.47,0.69 20.81,0.69 29.27,9.15 29.27,10.42 IC3.18
DROW_8
  Top 0.152: Q9.1 6.11,0.39 16.16,0.39 16.62,0.39 20.96,0.39 29.57,9 29.57,10.02 IC3.19
GND  (via drill 0.4)
  other vias: 3.01,0.76 28.89,12.28 31.55,13.27 39.55,12.58 4.51,0.76 0.76,3.01 0.76,5.01 0.76,7.01 0.76,9.01 0.76,11.01 0.76,13.01 0.76,15.01 0.76,17.01 0.76,19.01 0.76,21.01 0.76,23.01 0.76,25.01 0.76,27.01 23.01,0.76 24.01,0.76 28.01,0.76 36.51,0.76 33.01,0.76 30.51,0.76 41.01,0.76 39.51,0.76 38.01,0.76 43.26,3.01 43.26,5.01 43.26,7.01 43.26,9.01 43.26,11.01 43.26,13.01 43.26,15.01 43.26,17.01 43.26,19.01 43.26,21.01 43.26,23.01 43.26,25.01 43.26,27.01 40.76,29.76 39.26,29.76 30.26,29.76 28.26,29.76 26.26,29.76 13.26,29.76 11.26,29.76 9.26,29.76 7.26,29.76 5.26,29.76 3.26,29.76 6.3,24.96 11.18,26.4 11.18,24.96 20.05,25.53 17,25.53 14.26,25.53 23.53,26.79 27.18,18.63 28.86,20.31 34.58,23.43 36.18,24.12 37.47,22.75 33.58,11.32 36.4,15.58 33.84,15.48 39.83,15.81 24.92,9.91 26.52,8.16 38.79,10.6 38.34,11.51
  pour Bottom: 0.01,0.01 0.01,30.51 44.01,30.51 44.01,0.01
  pour Top: 0.01,0.01 0.01,30.51 44.01,30.51 44.01,0.01
N$2
  Top 0.152: R13.P$2 27.54,11.3 IC1.15
N$6
  Top 0.152: R21.P$2 29.79,6.25 X2.2
N$20
  Top 0.152: R24.P$2 31.04,5.98 X2.3
N$22
  Top 0.61: C3.P$1 37.43,6.54 IC2.4
N$40
  Top 0.152: Q1.3 30.86,19.13 IC3.5
ROW_1
  Top 0.305: D8.A D7.A D6.A D5.A D4.A D3.A D2.A D1.A
  Top 0.406: D1.A 21.2,25.13 Q2.3
ROW_2
  Top 0.305: D16.A D15.A D14.A D13.A D12.A D11.A D10.A D9.A
  Top 0.406: D9.A 18.76,25.18 Q3.3
ROW_3
  Top 0.305: D24.A D23.A D22.A D21.A D20.A D19.A D18.A D17.A
  Top 0.406: D17.A 16.33,24.5 Q4.3
ROW_4
  Top 0.305: D32.A D31.A D30.A D29.A D28.A D27.A D26.A D25.A
  Top 0.406: D25.A 13.89,24.84 13.27,25.46 13.22,25.5 Q5.3
ROW_5
  Top 0.305: D40.A D39.A D38.A D37.A D36.A D35.A D34.A D33.A
  Top 0.406: D40.A 13.17,4.46 Q6.3
ROW_6
  Top 0.305: D48.A D47.A D46.A D45.A D44.A D43.A D42.A D41.A
  Top 0.406: D48.A 10.73,4.46 Q7.3
ROW_7
  Top 0.305: D56.A D55.A D54.A D53.A D52.A D51.A D50.A D49.A
  Top 0.406: D56.A 8.29,4.46 Q8.3
ROW_8
  Top 0.305: D64.A D63.A D62.A D61.A D60.A D59.A D58.A D57.A
  Top 0.406: D64.A 5.19,5.12 Q9.3
RST  (via drill 0.4)
  Top 0.152: IC3.7 30.26,18.32 v30.26,18.9 | JP1.10 36.48,26.3 v37.95,26.3 38.03,26.37 C6.P$2
  Bottom 0.152: v30.26,18.9 37.34,18.9 38.03,19.59 38.03,26.22 v37.95,26.3
RXD  (via drill 0.4)
  Top 0.152: R21.P$1 29.8,8.68 R19.P$2 30.19,9.7 v30.79,10.29 | v36.35,13.27 36.35,12.93 IC3.31
  Bottom 0.152: v30.79,10.29 33.38,10.29 v36.35,13.27
TCK  (via drill 0.4)
  Top 0.152: IC3.37 39.71,16.62 39.71,17.91 39.71,23.17 v37.42,25.46 | v33.31,25.08 32.49,25.89 JP1.4
  Bottom 0.152: v37.42,25.46 33.69,25.46 v33.31,25.08
TDI
  Top 0.152: IC3.38 39.33,16.94 39.33,17.91 39.33,22.71 36.66,25.38 35.36,25.38 35.06,25.69 35.06,26.45 JP1.8
TDO
  Top 0.152: IC3.39 38.94,17.27 38.94,18.07 38.94,22.64 36.51,25.08 34.3,25.08 33.76,25.61 JP1.6
TMS  (via drill 0.4)
  Top 0.152: IC3.34 37.53,13.87 v37.12,13.87 | v38.18,18.52 38.18,22.94 36.43,24.7 34.83,24.7 v34.37,24.24 | v31.25,24.92 31.25,26.45 JP1.2
  Bottom 0.152: v37.12,13.87 37.57,13.87 38.11,14.41 38.11,18.45 v38.18,18.52 | v34.37,24.24 31.93,24.24 v31.25,24.92
TXD  (via drill 0.4)
  Top 0.152: R24.P$1 32.23,7.77 v32.62,8.16 | v37.95,10.75 37.83,10.75 IC3.30
  Bottom 0.152: v32.62,8.16 35.36,8.16 v37.95,10.75

### Text on the board
tPlace: SimpLux V0.1 | CC-BY-SA | (C) Piotr Esden-Tempski 2010